# Altium project PCB_Project.PrjPcb
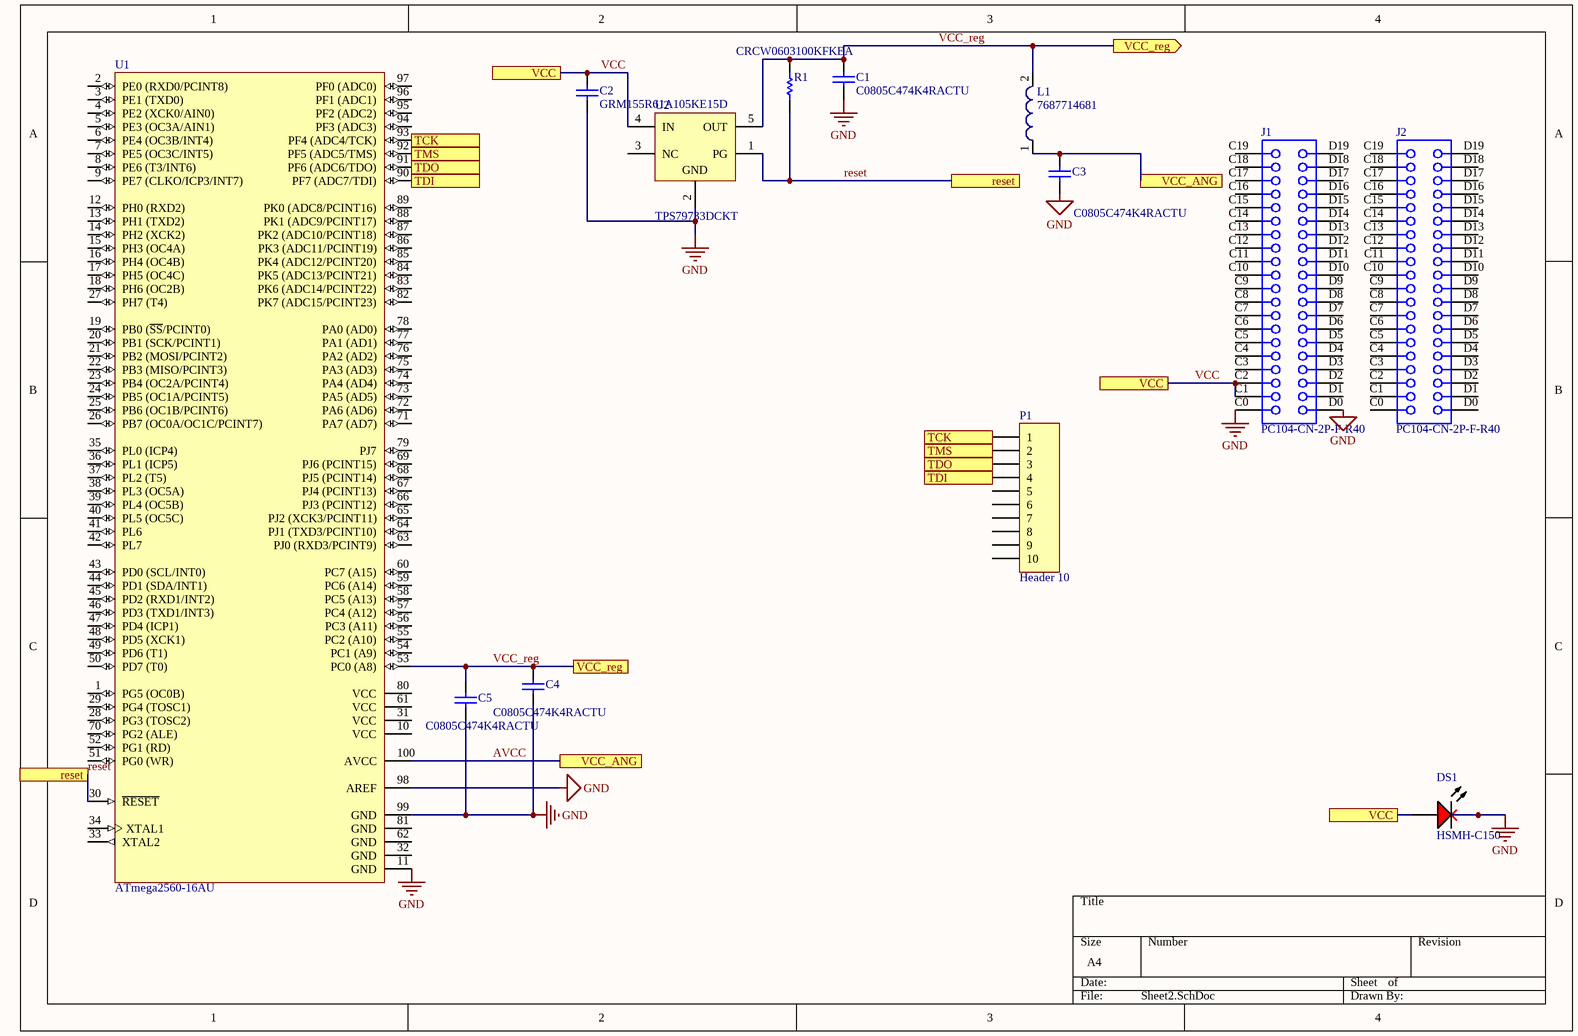
[diagram p0: Sheet2.SchDoc]
1 sheet, 13 parts. Net scope: flat (ports and power ports of the same name join across sheets).
Board file: PCB1.PcbDoc

## Sheet Sheet2.SchDoc
size A4

### Parts
C1  C0805C474K4RACTU  [CAPC2013X140X50LL20T25]
C2  GRM155R61A105KE15D  [CAPC1005X55X25NL05T10]
C3  C0805C474K4RACTU  [CAPC2013X140X50LL20T25]
C4  C0805C474K4RACTU  [CAPC2013X140X50LL20T25]
C5  C0805C474K4RACTU  [CAPC2013X140X50LL20T25]
DS1  HSMH-C150  [AVAG-HSMX-C150_V]
J1  PC104-CN-2P-F-R40  [BTB2-54-V40F-04]
J2  PC104-CN-2P-F-R40  [BTB2-54-V40F-04]
L1  7687714681  [1060]
P1  Header 10  [HDR2X10_CEN]
R1  CRCW0603100KFKEA  [RESC1609X50X30LL10T20]
U1  ATmega2560-16AU  [100A_M]
U2  TPS79733DCKT  [DCK0005A_N]

### Ports
reset, TCK, TDI, TDO, TMS, VCC, VCC_ANG, VCC_reg, VCC_reg (out)

### Nets
GND: C1.1 C2.1 C3.1 C4.1 C5.1 DS1.2(K) J1.C0 J1.D0 U1.11(GND) U1.98(AREF) U1.99(GND) U2.2(GND)
AVCC: C3.2 L1.1 U1.100(AVCC) ; port VCC_ANG
reset: R1.1 U1.30(~{RESET}) U2.1(PG) ; port reset
VCC: C2.2 DS1.1(A) J1.C1 J1.C2 U2.4(IN) ; port VCC
VCC_reg: C1.2 C4.2 C5.2 L1.2 R1.2 U1.53(PC0_(A8)) U2.5(OUT) ; port VCC_reg
NetP1_1: P1.1 U1.93(PF4_(ADC4/TCK)) ; port TCK
NetP1_2: P1.2 U1.92(PF5_(ADC5/TMS)) ; port TMS
NetP1_3: P1.3 U1.91(PF6_(ADC6/TDO)) ; port TDO
NetP1_4: P1.4 U1.90(PF7_(ADC7/TDI)) ; port TDI

Not connected (* = marked no-connect by the designer): J1 C3(24) C4(25) C5(26) C6(27) C7(28) C8(29) C9(30) C10(31) C11(32) C12(33) C13(34) C14(35) C15(36) C16(37) C17(38) C18(39) C19(40) D1(2) D2(3) D3(4) D4(5) D5(6) D6(7) D7(8) D8(9) D9(10) D10(11) D11(12) D12(13) D13(14) D14(15) D15(16) D16(17) D17(18) D18(19) D19(20); J2 C0(21) C1(22) C2(23) C3(24) C4(25) C5(26) C6(27) C7(28) C8(29) C9(30) C10(31) C11(32) C12(33) C13(34) C14(35) C15(36) C16(37) C17(38) C18(39) C19(40) D0(1) D1(2) D2(3) D3(4) D4(5) D5(6) D6(7) D7(8) D8(9) D9(10) D10(11) D11(12) D12(13) D13(14) D14(15) D15(16) D16(17) D17(18) D18(19) D19(20); P1 5 6 7 8 9 10; U1 1(PG5_(OC0B)) 2(PE0_(RXD0/PCINT8)) 3(PE1_(TXD0)) 4(PE2_(XCK0/AIN0)) 5(PE3_(OC3A/AIN1)) 6(PE4_(OC3B/INT4)) 7(PE5_(OC3C/INT5)) 8(PE6_(T3/INT6)) 9(PE7_(CLKO/ICP3/INT7)) 10(VCC) 12(PH0_(RXD2)) 13(PH1_(TXD2)) 14(PH2_(XCK2)) 15(PH3_(OC4A)) 16(PH4_(OC4B)) 17(PH5_(OC4C)) 18(PH6_(OC2B)) 19(PB0_(~{SS}/PCINT0)) 20(PB1_(SCK/PCINT1)) 21(PB2_(MOSI/PCINT2)) 22(PB3_(MISO/PCINT3)) 23(PB4_(OC2A/PCINT4)) 24(PB5_(OC1A/PCINT5)) 25(PB6_(OC1B/PCINT6)) 26(PB7_(OC0A/OC1C/PCINT7)) 27(PH7_(T4)) 28(PG3_(TOSC2)) 29(PG4_(TOSC1)) 31(VCC) 32(GND) 33(XTAL2) 34(XTAL1) 35(PL0_(ICP4)) 36(PL1_(ICP5)) 37(PL2_(T5)) 38(PL3_(OC5A)) 39(PL4_(OC5B)) 40(PL5_(OC5C)) 41(PL6) 42(PL7) 43(PD0_(SCL/INT0)) 44(PD1_(SDA/INT1)) 45(PD2_(RXD1/INT2)) 46(PD3_(TXD1/INT3)) 47(PD4_(ICP1)) 48(PD5_(XCK1)) 49(PD6_(T1)) 50(PD7_(T0)) 51(PG0_(WR)) 52(PG1_(RD)) 54(PC1_(A9)) 55(PC2_(A10)) 56(PC3_(A11)) 57(PC4_(A12)) 58(PC5_(A13)) 59(PC6_(A14)) 60(PC7_(A15)) 61(VCC) 62(GND) 63(PJ0_(RXD3/PCINT9)) 64(PJ1_(TXD3/PCINT10)) 65(PJ2_(XCK3/PCINT11)) 66(PJ3_(PCINT12)) 67(PJ4_(PCINT13)) 68(PJ5_(PCINT14)) 69(PJ6_(PCINT15)) 70(PG2_(ALE)) 71(PA7_(AD7)) 72(PA6_(AD6)) 73(PA5_(AD5)) 74(PA4_(AD4)) 75(PA3_(AD3)) 76(PA2_(AD2)) 77(PA1_(AD1)) 78(PA0_(AD0)) 79(PJ7) 80(VCC) 81(GND) 82(PK7_(ADC15/PCINT23)) 83(PK6_(ADC14/PCINT22)) 84(PK5_(ADC13/PCINT21)) 85(PK4_(ADC12/PCINT20)) 86(PK3_(ADC11/PCINT19)) 87(PK2_(ADC10/PCINT18)) 88(PK1_(ADC9/PCINT17)) 89(PK0_(ADC8/PCINT16)) 94(PF3_(ADC3)) 95(PF2_(ADC2)) 96(PF1_(ADC1)) 97(PF0_(ADC0)); U2 3(NC)

### Library data of the parts
C1 C3-C5 = CMP-2007-03296-1: Manufacturer: Kemet; Part Number: C0805C474K4RACTU
C2 = CMP-2008-04556-1: Manufacturer: Murata; Part Number: GRM155R61A105KE15D
DS1 = CMP-2000-06426-1: LED Uni-Color Red, 65 mW, 25 mA, -40 to 85 degC, 2-Pin SMD, RoHS, Tape and Reel; Manufacturer: Avago; Product Height (mm): 1.1mm; Power Dissipation: 78W; Product Length (mm): 3.2mm; Forward Voltage: 2.6V; Luminous Intensity: 17mcd; DELETED: Compliant; Shape Type: Rectangular; Peak Wavelength: 660nm; Main Category: ChipLED; Dominant Wave Length: 639nm; Rad Hardened: No; Lens Type: ColorlessDiffused; Product Depth (mm): 1.6mm; Reverse Voltage: 5V; Forward Current: 25mA; Chip Material: GaAlAs; Test Current (It): 20mA; Viewing Angle: 170deg; Number of  Elements: 1; Type: Uni-Color; Package Reference: HSMX-C150; Package Description: 2-Pin Surface Mount Device, Body 3.2 x 1.6 mm; Operating Temp Range: -40Cto85C; Mounting: SurfaceMount; Emitting Color: Red; Pin Count: 2; Operating Temperature Classification: Industrial; Datasheet URL: http://media.digikey.com/pdf/Data%20Sheets/Avago%20PDFs/HSMz-Czzz.pdf; Package Type: ChipLed; Mounting Technology: SurfaceMount; High Brightness: No; Lens Dimensions: 2x1.6x0.6mm; Manufacturer URL: http://www.avagotech.com/; Lum Intensity: 17mcd; Datasheet Version: 03/2012; Packaging: TapeandReel
J1 J2 = CMP-0001-00107-1: Board-to-Board Connector, PC104 CD ISA, Stackthrough, Vertical, 2-Row, 40-Postion, Pitch 2.54mm, Receptacle; Mating Connector: Harwin-M20-6102005 (stackthrough); Package Reference: BTB2-54-V40F-04; ClassName: Board Template Connector; Component Kind: Standard; Publisher: Altium
L1 = CMP-1387-00003-1: SMD Power Inductor WE-PD HV, L=680 µH; Manufacturer: Wuerth Elektronik; Inductance: 680 ÂµH; PackageReference: 1060; ComponentLink1URL: http://www.we-online.com; PartNumber: 7687714681; ComponentLink1Description: Manufacturer URL; ComponentLink2Description: Datasheet; ComponentLink2URL: http://www.we-online.de/katalog/media/pdf/7687714681.pdf
P1 = Header 10: Header, 10-Pin; LatestRevisionDate: 17-Jul-2002; LatestRevisionNote: Re-released for DXP Platform.; Publisher: Altium Limited
R1 = CMP-2000-03820-1: Manufacturer: Vishay Dale; Part Number: CRCW0603100KFKEA
U1 = CMP-0095-00210-2: 8-bit AVR Microcontroller, 4.5-5.5V, 16MHz, 256KB Flash, 4KB EEPROM, 8KB SRAM, 86 GPIO pins, 100-pin TQFP, Industrial Grade (-40°C to 85°C), Pb-Free; PackageDescription: 100-Pin Thin Profile Plastic Quad Flat Pack (TQFP), 14 x 14 x 1.0 mm Body, 0.5 mm Pitch; ComponentLink1Description: Manufacturer URL; ComponentLink3URL: http://www.atmel.com/dyn/resources/prod_documents/2549S.pdf; RevisionNote: DatasheetVersion & PackageVersion updated. URLs added.; DatasheetVersion: revN, May-2011; ComponentLink2Description: ATmega640/1280/1281/2560/2561 Datasheet; PackageReference: 100A; PackageVersion: revD, Oct-2010; Code_JEDEC: MS-026-AED; ComponentLink1URL: http://www.atmel.com/; ComponentLink2URL: http://www.atmel.com/dyn/resources/prod_documents/doc2549.pdf; ComponentLink3Description: ATmega640/1280/1281/2560/2561 Summary
U2 = CMP-0394-00889-2: Single Output LDO, 50 mA, Fixed 3.3 V Output, 1.8 to 5.5 V Input, with Low IQ, 5-pin SC70 (DCK), -40 to 85 degC, Green (RoHS & no Sb/Br); Manufacturer: Texas Instruments; Iout(Max)(A): 0.05; Iq(Typ)(mA): 0.001; Power Good: TRUE; Vin(Min)(V): 1.8; Vout Adj(Max)(V): 3.3; Rating: Catalog; Vin(Max)(V): 5.5; Accuracy(%): 4; Vdo(Typ)(mV): 105; SubFamily: Single Channel LDO; PackageReference: DCK0005A; ComponentLink3Description: Package Specification; ComponentLink2Description: Datasheet; Code_JEDEC: MO-203; DatasheetVersion: SLVS332H; PackageVersion: 4093553-3/G; PartNumber: TPS79733DCKT; PackageDescription: 5-Pin Plastic Small-Outline, Body 2 x 1.25 mm, Pitch 0.65 mm; ComponentLink2URL: http://www.ti.com/general/docs/lit/getliterature.tsp?genericPartNumber=TPS79733&fileType=pdf; Vout Adj(Min)(V): 3.3; ComponentLink1URL: http://www.ti.com/; ComponentLink3URL: http://www.ti.com/litv/pdf/mpds025f; Mounting Technology: Surface Mount; Eco-Plan: Green (RoHS & no Sb/Br); Fixed Output Options(V): 3.3; ComponentLink1Description: Manufacturer URL